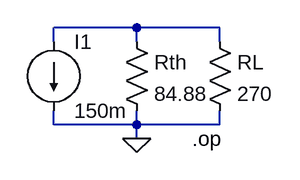
[diagram p0: schematic Norton_2_2.asc]
Norton_2_2.asc, the LTspice schematic file:
Version 4
SHEET 1 880 680
WIRE 96 128 0 128
WIRE 192 128 96 128
WIRE 0 144 0 128
WIRE 96 144 96 128
WIRE 192 144 192 128
WIRE 0 240 0 224
WIRE 96 240 96 224
WIRE 96 240 0 240
WIRE 192 240 192 224
WIRE 192 240 96 240
WIRE 96 256 96 240
FLAG 96 256 0
SYMBOL current 0 144 R0
WINDOW 123 0 0 Left 0
WINDOW 39 0 0 Left 0
SYMATTR InstName I1
SYMATTR Value 150m
SYMBOL res 80 128 R0
SYMATTR InstName Rth
SYMATTR Value 84.88
SYMBOL res 176 128 R0
SYMATTR InstName RL
SYMATTR Value 270
TEXT 160 256 Left 2 !.op

The netlist it stands for:
* Norton_2_2.asc
I1 N001 0 150m
Rth N001 0 84.88
RL N001 0 270
.op
.backanno
.end